# EAGLE design MainPromSignController (EAGLE 7.5.0)
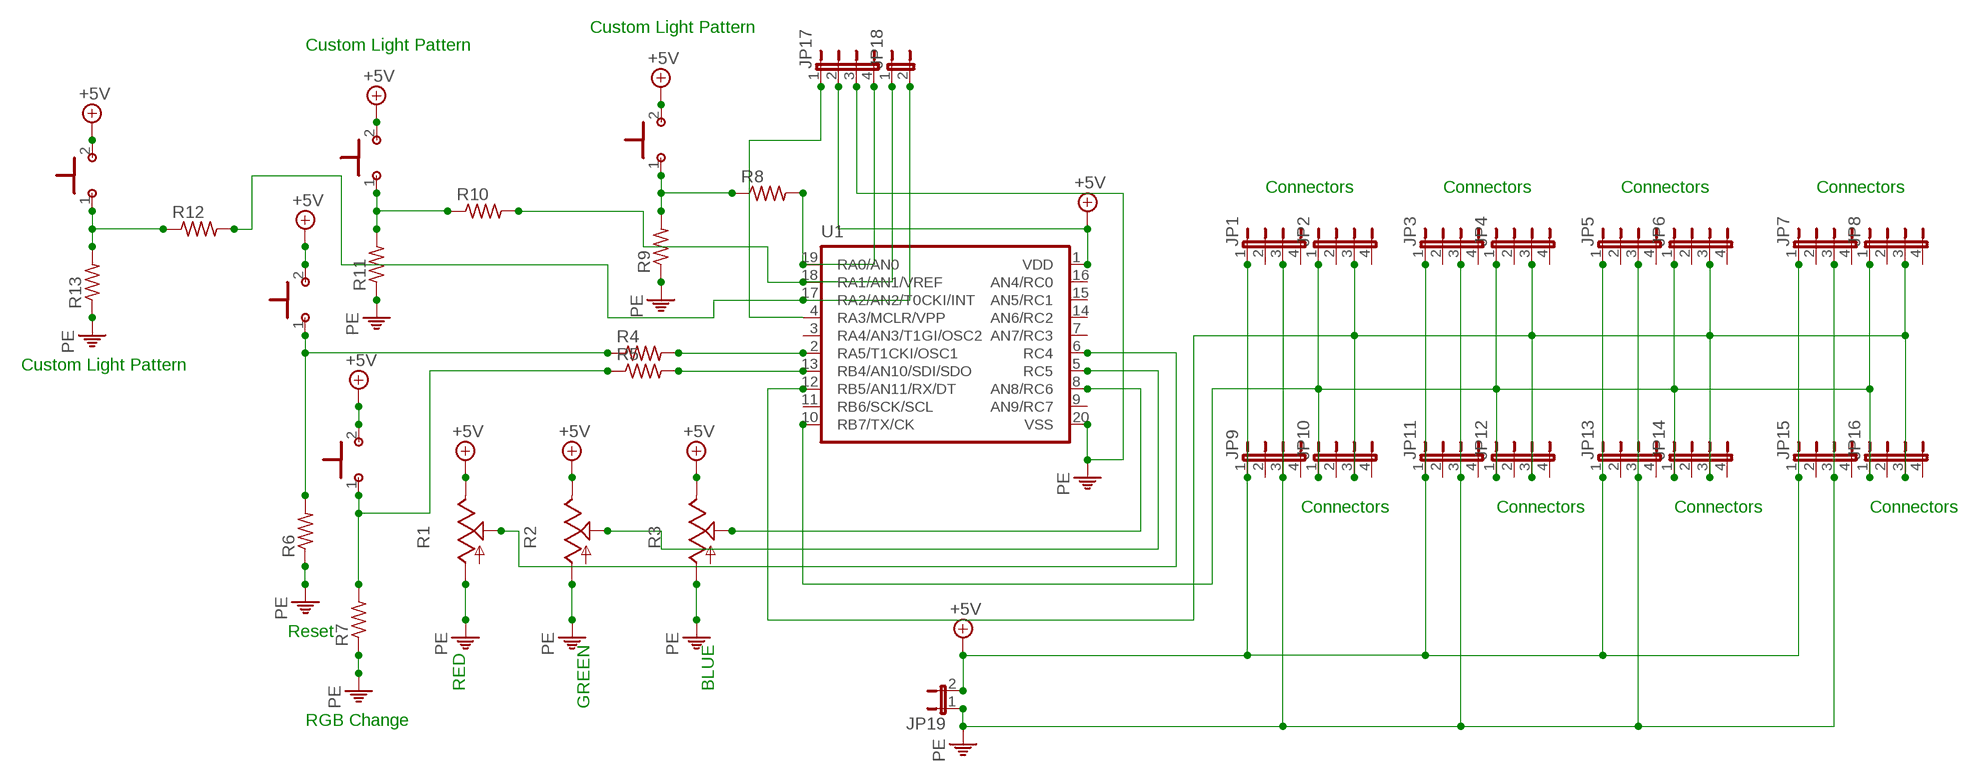
[diagram p0: schematic, sheet 1]

## Parts
JP1  JP4E  [JP4]
JP2  JP4E  [JP4]
JP3  JP4E  [JP4]
JP4  JP4E  [JP4]
JP5  JP4E  [JP4]
JP6  JP4E  [JP4]
JP7  JP4E  [JP4]
JP8  JP4E  [JP4]
JP9  JP4E  [JP4]
JP10  JP4E  [JP4]
JP11  JP4E  [JP4]
JP12  JP4E  [JP4]
JP13  JP4E  [JP4]
JP14  JP4E  [JP4]
JP15  JP4E  [JP4]
JP16  JP4E  [JP4]
JP17  JP4E  [JP4]
JP18  JP1E  [JP1]
JP19  JP1E  [JP1]
R1  TRIM_US-B25P  [B25P]
R2  TRIM_US-B25P  [B25P]
R3  TRIM_US-B25P  [B25P]
R4  R-US_0207/10  [0207/10]
R5  R-US_0207/10  [0207/10]
R6  R-US_0207/10  [0207/10]
R7  R-US_0207/10  [0207/10]
R8  R-US_0207/10  [0207/10]
R9  R-US_0207/10  [0207/10]
R10  R-US_0207/10  [0207/10]
R11  R-US_0207/10  [0207/10]
R12  R-US_0207/10  [0207/10]
R13  R-US_0207/10  [0207/10]
U1  PIC16F6XX  [DIL20]
U$1  PUSHBUTTON  [PUSHBUTTON]
U$2  PUSHBUTTON  [PUSHBUTTON]
U$3  PUSHBUTTON  [PUSHBUTTON]
U$4  PUSHBUTTON  [PUSHBUTTON]
U$5  PUSHBUTTON  [PUSHBUTTON]

## Nets
+5V: JP1.1 JP3.1 JP5.1 JP7.1 JP9.1 JP11.1 JP13.1 JP15.1 JP17.2 JP19.2 R1.E R2.E R3.E U1.1(VDD) U$1.2 U$2.2 U$3.2 U$4.2 U$5.2
N$1: R1.S U1.6(RC4)
N$2: R2.S U1.5(RC5)
N$3: R3.S U1.8(AN8/RC6)
N$4: R4.2 U1.2(RA5/T1CKI/OSC1)
N$5: R5.2 U1.13(RB4/AN10/SDI/SDO)
N$7: R5.1 R7.2 U$2.1
N$8: R4.1 R6.2 U$1.1
N$9: JP17.1 U1.4(RA3/MCLR/VPP)
N$10: R8.1 R9.2 U$3.1
N$11: JP2.3 JP4.3 JP6.3 JP8.3 JP10.3 JP12.3 JP14.3 JP16.3 U1.12(RB5/AN11/RX/DT)
N$12: R10.1 R11.2 U$4.1
N$14: R12.1 R13.2 U$5.1
N$15: JP18.2 R12.2 U1.17(RA2/AN2/T0CKI/INT)
N$16: JP17.4 R8.2 U1.19(RA0/AN0)
N$17: JP18.1 R10.2 U1.18(RA1/AN1/VREF)
N$32: JP2.1 JP4.1 JP6.1 JP8.1 JP10.1 JP12.1 JP14.1 JP16.1 U1.10(RB7/TX/CK)
PE: JP1.3 JP3.3 JP5.3 JP7.3 JP9.3 JP11.3 JP13.3 JP15.3 JP17.3 JP19.1 R1.A R2.A R3.A R6.1 R7.1 R9.1 R11.1 R13.1 U1.20(VSS)
Unconnected: JP1.2 JP1.4 JP2.2 JP2.4 JP3.2 JP3.4 JP4.2 JP4.4 JP5.2 JP5.4 JP6.2 JP6.4 JP7.2 JP7.4 JP8.2 JP8.4 JP9.2 JP9.4 JP10.2 JP10.4 JP11.2 JP11.4 JP12.2 JP12.4 JP13.2 JP13.4 JP14.2 JP14.4 JP15.2 JP15.4 JP16.2 JP16.4 U1.3(RA4/AN3/T1GI/OSC2) U1.7(AN7/RC3) U1.9(AN9/RC7) U1.11(RB6/SCK/SCL) U1.14(AN6/RC2) U1.15(AN5/RC1) U1.16(AN4/RC0)

## Notes on the sheet
- Custom Light Pattern
- Custom Light Pattern
- Connectors | Connectors | Connectors | Connectors
- Custom Light Pattern
- Connectors | Connectors | Connectors | Connectors
- Reset
- RED | BLUE
- GREEN
- RGB Change

## Library data of the parts
JP1-JP17 = jumper:JP4E: JUMPER
JP18 JP19 = jumper:JP1E: JUMPER
R1-R3 = pot:TRIM_US-: POTENTIOMETER
R4-R13 = resistor:R-US_: RESISTOR, American symbol
U1 = pic16f690:PIC16F6XX
U$1-U$5 = TEJ4M1:PUSHBUTTON

## Board
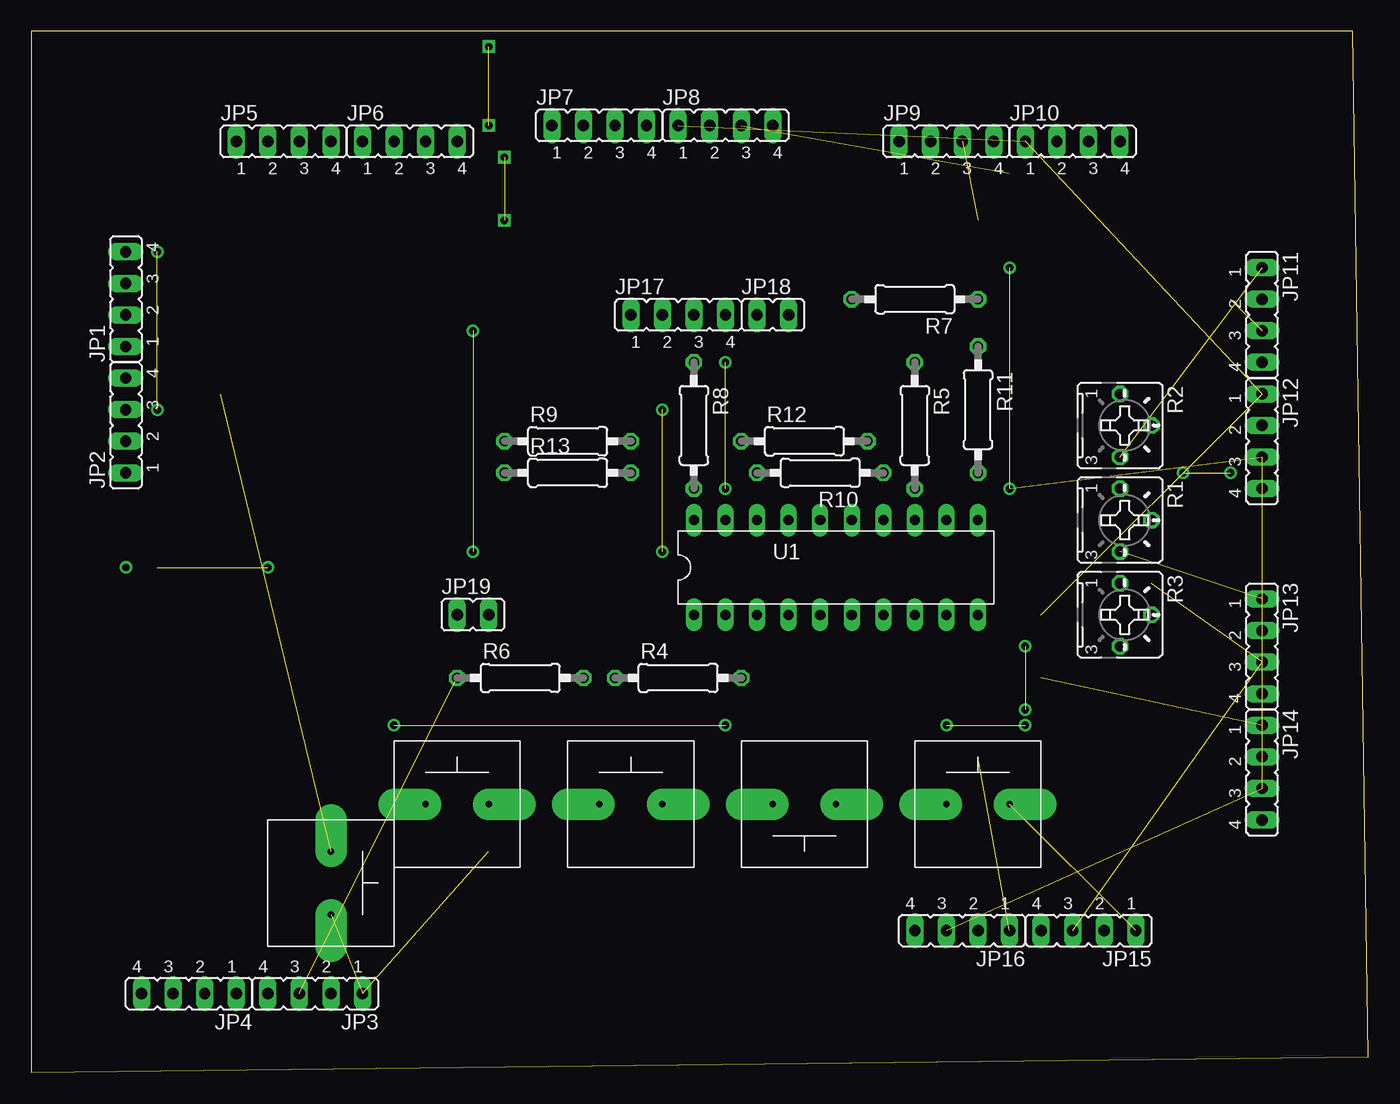
[diagram p1: board, top side]
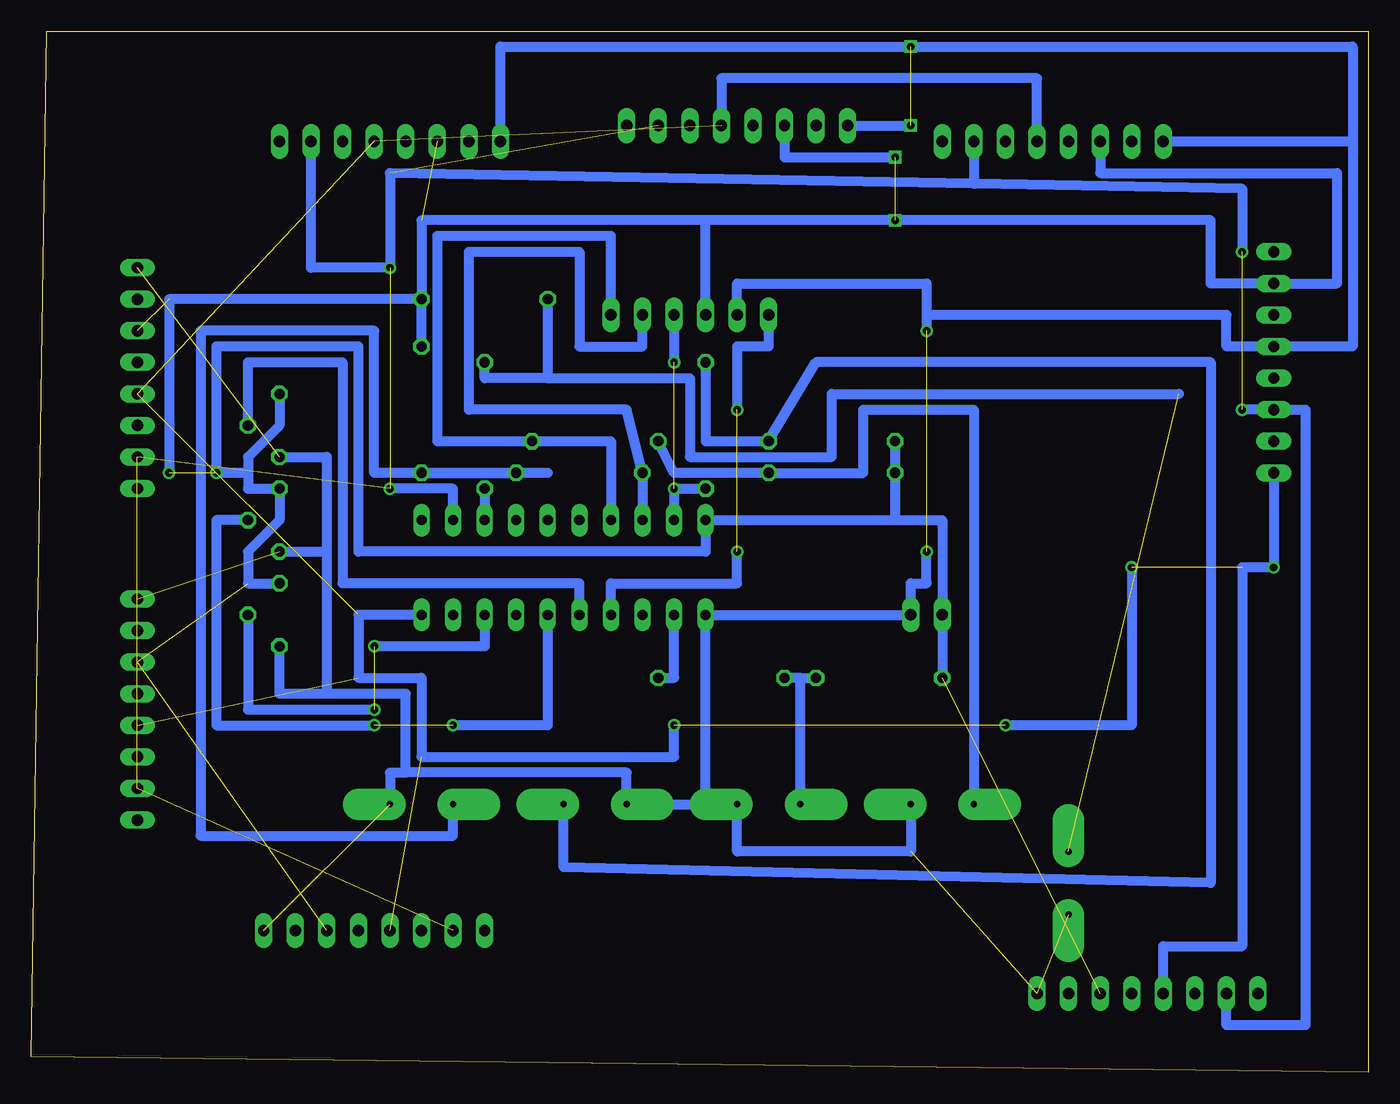
[diagram p2: board, bottom side, seen from below]

Size 107.62 x 83.81 mm. Coordinates in mm from the lower left corner, seen from the top.
Outline: 0,0 107.62,1.27 106.35,83.81 0,83.81 0,0
Copper layers (1*16): Top 0.035mm / dielectric 1.5mm / Bottom 0.035mm
Design rules "default": minimum track width 10mil, minimum drill 24mil, track to track 8mil, track to pad 8mil, pad to pad 8mil, via to via 8mil, smd to smd 8mil, copper to edge 40mil, drill to drill 8mil, minimum pad ring 10mil, minimum via ring 8mil, stop-mask expansion 4mil, vias tented up to drill 0mil, thermal gap 10mil

### Footprints (pad centres in the part's own frame; a part is rotated, then mirrored left to right if it is on the bottom)
JP4 = drill 0.914 long: 1 -3.81,0; 2 -1.27,0; 3 1.27,0; 4 3.81,0
JP1 = drill 0.914 long: 1 0,-1.27; 2 0,1.27
B25P = drill 0.813 octagon: A -2.54,0; E 2.54,0; S 0,2.54
0207/10 = drill 0.813 octagon: 1 -5.08,0; 2 5.08,0
DIL20 = drill 0.813 long: 1 -11.43,-3.81; 2 -8.89,-3.81; 3 -6.35,-3.81; 4 -3.81,-3.81; 5 -1.27,-3.81; 6 1.27,-3.81; 7 3.81,-3.81; 8 6.35,-3.81; 9 8.89,-3.81; 10 11.43,-3.81; 11 11.43,3.81; 12 8.89,3.81; 13 6.35,3.81; 14 3.81,3.81; 15 1.27,3.81; 16 -1.27,3.81; 17 -3.81,3.81; 18 -6.35,3.81; 19 -8.89,3.81; 20 -11.43,3.81
PUSHBUTTON = drill 0.5 pad 2.54 offset: 1 -2.54,0; 2 2.54,0

### Placement (x,y rotation side)
JP1  7.62,62.23 90 top
JP2  7.62,52.07 90 top
JP3  22.86,6.35 180 top
JP4  12.7,6.35 180 top
JP5  20.32,74.93 0 top
JP6  30.48,74.93 0 top
JP7  45.72,76.2 0 top
JP8  55.88,76.2 0 top
JP9  73.66,74.93 0 top
JP10  83.82,74.93 0 top
JP11  99.06,60.96 270 top
JP12  99.06,50.8 270 top
JP13  99.06,34.29 270 top
JP14  99.06,24.13 270 top
JP15  85.09,11.43 180 top
JP16  74.93,11.43 180 top
JP17  52.07,60.96 0 top
JP18  59.69,60.96 270 top
JP19  35.56,36.83 270 top
R1  87.63,44.45 270 top
R2  87.63,52.07 270 top
R3  87.63,36.83 270 top
R4  52.07,31.75 0 top
R5  71.12,52.07 270 top
R6  39.37,31.75 0 top
R7  71.12,62.23 180 top
R8  53.34,52.07 270 top
R9  43.18,50.8 0 top
R10  63.5,48.26 180 top
R11  76.2,53.34 270 top
R12  62.23,50.8 0 top
R13  43.18,48.26 0 top
U1  64.77,40.64 0 top
U$1  48.26,21.59 0 top
U$2  24.13,15.24 270 top
U$3  62.23,21.59 180 top
U$4  76.2,21.59 0 top
U$5  34.29,21.59 0 top

### Tracks (layer width: path | path; a pad name or v marks a point on that pad's centre or on a via)
+5V  (via drill 0.6)  (7 unrouted)
  Bottom 0.813: 53.34,21.59 U$1.2 50.8,17.78 36.83,17.78 U$5.2 | 53.34,21.59 U1.1 JP19.2 36.83,39.37 35.56,39.37 v35.56,41.91 | 53.34,21.59 U$3.2 59.69,24.13 77.47,24.13 | U$4.2 78.74,24.13 77.47,24.13 | 77.47,24.13 77.47,30.48 83.82,30.48 | R2.E 83.82,49.53 83.82,41.91 | R1.E 83.82,41.91 | 83.82,41.91 83.82,30.48 | 83.82,30.48 87.63,30.48 R3.E | JP17.2 50.8,63.5 35.56,63.5 35.56,60.96 | 35.56,60.96 v35.56,59.69 | 35.56,60.96 11.43,60.96 11.43,58.42 JP1.1 1.27,58.42 1.27,74.93 | JP5.1 1.27,74.93 | JP9.1 69.85,82.55 v36.83,82.55 1.27,82.55 1.27,74.93 | JP7.1 v36.83,76.2
N$1  (via drill 0.6)  (1 unrouted)
  Bottom 0.813: R1.S 92.71,44.45 92.71,27.94 v80.01,27.94 | U1.6 66.04,27.94 v73.66,27.94
N$2
  Bottom 0.813: U1.5 63.5,39.37 82.55,39.37 82.55,57.15 90.17,57.15 R2.S
N$3  (via drill 0.6)  (1 unrouted)
  Bottom 0.813: R3.S 90.17,29.21 v80.01,29.21 | U1.8 71.12,34.29 v80.01,34.29
N$4
  Bottom 0.813: R4.2 55.88,31.75 U1.2
N$5
  Bottom 0.813: R5.2 U1.13
N$6  (via drill 0.6)
  other vias: 78.74,64.77
N$7  (1 unrouted)
  Bottom 0.813: R7.2 66.04,55.88 | 66.04,55.88 54.61,55.88 54.61,49.53 43.18,49.53 43.18,54.61 15.24,54.61 | 66.04,55.88 71.12,55.88 R5.1
N$8
  Bottom 0.813: U$1.1 45.72,31.75 | 45.72,31.75 R6.2 | 45.72,31.75 R4.1
N$9  (via drill 0.6)  (1 unrouted)
  Bottom 0.813: U1.4 60.96,39.37 50.8,39.37 v50.8,41.91 | JP17.1 48.26,58.42 50.8,58.42 v50.8,53.34
N$10
  Bottom 0.813: U$3.1 64.77,16.51 12.7,15.24 12.7,57.15 44.45,57.15 R9.2 53.34,50.8 R8.1
N$11  (via drill 0.6)  (6 unrouted)
  Bottom 0.813: U1.12 73.66,46.99 v78.74,46.99 | v10.16,53.34 JP2.3 5.08,53.34 5.08,3.81 11.43,3.81 JP4.3 | 31.74,71.52 10.16,71.12 v10.16,66.04 | 31.74,71.52 78.74,72.39 78.74,64.77 85.09,64.77 JP10.3 | JP6.3 31.74,71.52
N$12
  Bottom 0.813: U$4.1 73.66,19.05 93.98,19.05 93.98,59.69 80.01,59.69 80.01,48.26 R10.1 | R11.2 R10.1 | 66.04,48.26 R10.1
N$13  (via drill 0.6)
  other vias: 7.62,40.64
N$14
  Bottom 0.813: U$5.1 31.75,53.34 40.64,53.34 40.64,48.26 R13.2 55.88,48.26 R12.1
N$15
  Bottom 0.813: U1.17 60.96,50.8 R12.2 74.93,50.8 74.93,67.31 60.96,67.31 JP18.2
N$16  (via drill 0.6)  (1 unrouted)
  Bottom 0.813: U1.19 v55.88,46.99 R8.2 | JP17.4 v55.88,57.15
N$17
  Bottom 0.813: U1.18 R10.2 59.69,53.34 72.39,53.34 72.39,66.04 63.5,66.04 63.5,58.42 58.42,58.42 JP18.1
N$32  (via drill 0.6)  (7 unrouted)
  Bottom 0.813: U1.10 81.28,36.83 81.28,31.75 76.2,31.75 76.2,25.4 55.88,25.4 v55.88,27.94 | JP2.1 7.62,40.64 10.16,40.64 10.16,10.16 16.51,10.16 JP4.1 | v19.05,40.64 19.05,27.94 v29.21,27.94 | JP6.1 26.67,80.01 52.07,80.01 JP8.1
PE  (via drill 0.6)  (7 unrouted)
  Bottom 0.813: 38.1,44.45 U1.20 53.34,41.91 81.28,41.91 81.28,58.42 92.71,58.42 v92.71,48.26 90.17,48.26 | R6.1 JP19.1 34.29,44.45 38.1,44.45 | R9.1 R13.1 38.1,44.45 | R2.A 87.63,52.07 90.17,49.53 90.17,48.26 | 90.17,48.26 90.17,46.99 R1.A 87.63,44.45 90.17,41.91 90.17,39.37 R3.A | R11.1 R7.1 | R7.1 96.52,62.23 v96.52,48.26 | JP17.3 53.34,68.58 | 53.34,68.58 76.2,68.58 R7.1 | 53.34,68.58 v38.1,68.58 12.7,68.58 12.7,63.5 JP1.3 2.54,63.5 2.54,72.39 21.59,72.39 JP5.3 | JP7.3 46.99,73.66 v38.1,73.66